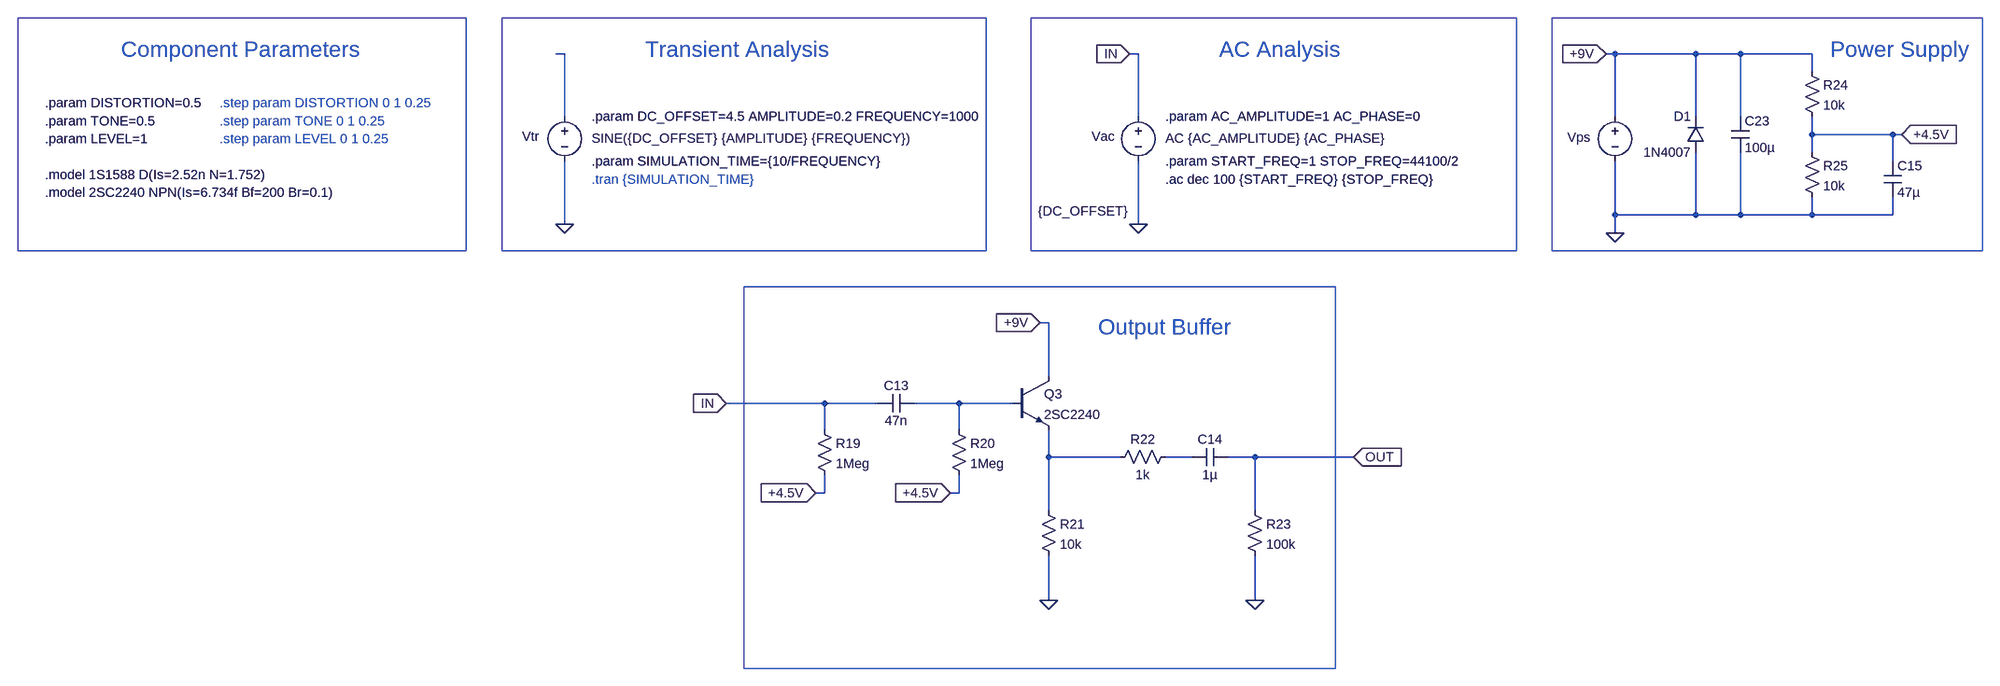
[diagram p0: schematic 6. Output Buffer.asc]
6. Output Buffer.asc, the LTspice schematic file:
Version 4
SHEET 1 6076 2100
WIRE 16 16 0 16
WIRE 1040 16 1024 16
WIRE 1904 16 1888 16
WIRE 2048 16 1904 16
WIRE 2128 16 2048 16
WIRE 2256 16 2128 16
WIRE 2256 48 2256 16
WIRE 16 128 16 16
WIRE 1040 128 1040 16
WIRE 1904 128 1904 16
WIRE 2048 128 2048 16
WIRE 2128 128 2128 16
WIRE 2256 160 2256 128
WIRE 2400 160 2256 160
WIRE 2416 160 2400 160
WIRE 2256 192 2256 160
WIRE 2400 208 2400 160
WIRE 1904 304 1904 208
WIRE 2048 304 2048 192
WIRE 2048 304 1904 304
WIRE 2128 304 2128 192
WIRE 2128 304 2048 304
WIRE 2256 304 2256 272
WIRE 2256 304 2128 304
WIRE 2400 304 2400 272
WIRE 2400 304 2256 304
WIRE 16 320 16 208
WIRE 1040 320 1040 208
WIRE 1904 336 1904 304
WIRE 880 496 864 496
WIRE 880 592 880 496
WIRE 480 640 304 640
WIRE 576 640 480 640
WIRE 720 640 640 640
WIRE 816 640 720 640
WIRE 480 688 480 640
WIRE 720 688 720 640
WIRE 880 736 880 688
WIRE 1008 736 880 736
WIRE 1136 736 1088 736
WIRE 1248 736 1200 736
WIRE 1424 736 1248 736
WIRE 480 800 480 768
WIRE 480 800 464 800
WIRE 720 800 720 768
WIRE 720 800 704 800
WIRE 880 832 880 736
WIRE 1248 832 1248 736
WIRE 880 992 880 912
WIRE 1248 992 1248 912
FLAG 1904 336 0
FLAG 1888 16 +9V
IOPIN 1888 16 In
FLAG 2416 160 +4.5V
IOPIN 2416 160 In
FLAG 1040 320 0
FLAG 16 320 0
FLAG 1424 736 OUT
IOPIN 1424 736 In
FLAG 1024 16 IN
IOPIN 1024 16 In
FLAG 880 992 0
FLAG 1248 992 0
FLAG 464 800 +4.5V
IOPIN 464 800 In
FLAG 704 800 +4.5V
IOPIN 704 800 In
FLAG 864 496 +9V
IOPIN 864 496 In
FLAG 304 640 IN
IOPIN 304 640 In
SYMBOL voltage 1904 112 R0
WINDOW 0 -85 53 Left 2
WINDOW 3 24 96 Invisible 2
WINDOW 123 0 0 Left 0
WINDOW 39 0 0 Left 0
SYMATTR InstName Vps
SYMATTR Value 9
SYMBOL cap 2112 128 R0
SYMATTR InstName C23
SYMATTR Value 100µ
SYMBOL cap 2384 208 R0
SYMATTR InstName C15
SYMATTR Value 47µ
SYMBOL res 2240 32 R0
SYMATTR InstName R24
SYMATTR Value 10k
SYMBOL res 2240 176 R0
SYMATTR InstName R25
SYMATTR Value 10k
SYMBOL diode 2064 192 R180
WINDOW 0 24 64 Left 2
WINDOW 3 24 0 Left 2
SYMATTR InstName D1
SYMATTR Value 1N4007
SYMBOL voltage 1040 112 R0
WINDOW 3 -179 185 Left 2
WINDOW 123 48 55 Left 2
WINDOW 39 0 0 Left 0
WINDOW 0 -83 52 Left 2
SYMATTR Value {DC_OFFSET}
SYMATTR Value2 AC {AC_AMPLITUDE} {AC_PHASE}
SYMATTR InstName Vac
SYMBOL voltage 16 112 R0
WINDOW 3 48 55 Left 2
WINDOW 123 29 129 Left 2
WINDOW 39 0 0 Left 0
WINDOW 0 -76 52 Left 2
SYMATTR Value SINE({DC_OFFSET} {AMPLITUDE} {FREQUENCY})
SYMATTR InstName Vtr
SYMBOL res 464 672 R0
SYMATTR InstName R19
SYMATTR Value 1Meg
SYMBOL res 704 672 R0
SYMATTR InstName R20
SYMATTR Value 1Meg
SYMBOL res 864 816 R0
SYMATTR InstName R21
SYMATTR Value 10k
SYMBOL res 1104 720 R90
WINDOW 0 0 56 VBottom 2
WINDOW 3 32 56 VTop 2
SYMATTR InstName R22
SYMATTR Value 1k
SYMBOL res 1232 816 R0
SYMATTR InstName R23
SYMATTR Value 100k
SYMBOL cap 640 624 R90
WINDOW 0 0 32 VBottom 2
WINDOW 3 32 32 VTop 2
SYMATTR InstName C13
SYMATTR Value 47n
SYMBOL cap 1200 720 R90
WINDOW 0 0 32 VBottom 2
WINDOW 3 32 32 VTop 2
SYMATTR InstName C14
SYMATTR Value 1µ
SYMBOL npn 816 592 R0
SYMATTR InstName Q3
SYMATTR Value 2SC2240
TEXT 2288 8 Left 4 ;Power Supply
TEXT -776 8 Left 4 ;Component Parameters
TEXT 1088 240 Left 2 !.ac dec 100 {START_FREQ} {STOP_FREQ}
TEXT 64 240 Left 2 ;.tran {SIMULATION_TIME}
TEXT -600 104 Left 2 ;.step param DISTORTION 0 1 0.25
TEXT -600 136 Left 2 ;.step param TONE 0 1 0.25
TEXT 968 504 Left 4 ;Output Buffer
TEXT 64 208 Left 2 !.param SIMULATION_TIME={10/FREQUENCY}
TEXT 160 8 Left 4 ;Transient Analysis
TEXT 64 128 Left 2 !.param DC_OFFSET=4.5 AMPLITUDE=0.2 FREQUENCY=1000
TEXT 1184 8 Left 4 ;AC Analysis
TEXT 1088 128 Left 2 !.param AC_AMPLITUDE=1 AC_PHASE=0
TEXT 1088 208 Left 2 !.param START_FREQ=1 STOP_FREQ=44100/2
TEXT -912 264 Left 2 !.model 2SC2240 NPN(Is=6.734f Bf=200 Br=0.1)
TEXT -912 232 Left 2 !.model 1S1588 D(Is=2.52n N=1.752)
TEXT -912 136 Left 2 !.param TONE=0.5
TEXT -912 168 Left 2 !.param LEVEL=1
TEXT -600 168 Left 2 ;.step param LEVEL 0 1 0.25
TEXT -912 104 Left 2 !.param DISTORTION=0.5
RECTANGLE Normal 1392 1120 336 432
RECTANGLE Normal 768 368 -96 -48
RECTANGLE Normal 1728 368 848 -48
RECTANGLE Normal 2560 368 1792 -48
RECTANGLE Normal -160 368 -960 -48

The netlist it stands for:
* 6. Output Buffer.asc
Vps +9V 0 9
C23 +9V 0 100µ
C15 +4.5V 0 47µ
R24 +9V +4.5V 10k
R25 +4.5V 0 10k
D1 0 +9V 1N4007
Vac IN 0 {DC_OFFSET} AC {AC_AMPLITUDE} {AC_PHASE}
Vtr N001 0 SINE({DC_OFFSET} {AMPLITUDE} {FREQUENCY})
R19 IN +4.5V 1Meg
R20 N002 +4.5V 1Meg
R21 N003 0 10k
R22 N004 N003 1k
R23 OUT 0 100k
C13 N002 IN 47n
C14 OUT N004 1µ
Q3 +9V N002 N003 0 2SC2240
.model D D
.lib standard.dio
.model NPN NPN
.model PNP PNP
.lib standard.bjt
* Power Supply
* Component Parameters
.ac dec 100 {START_FREQ} {STOP_FREQ}
* .tran {SIMULATION_TIME}
* .step param DISTORTION 0 1 0.25
* .step param TONE 0 1 0.25
* Output Buffer
.param SIMULATION_TIME={10/FREQUENCY}
* Transient Analysis
.param DC_OFFSET=4.5 AMPLITUDE=0.2 FREQUENCY=1000
* AC Analysis
.param AC_AMPLITUDE=1 AC_PHASE=0
.param START_FREQ=1 STOP_FREQ=44100/2
.model 2SC2240 NPN(Is=6.734f Bf=200 Br=0.1)
.model 1S1588 D(Is=2.52n N=1.752)
.param TONE=0.5
.param LEVEL=1
* .step param LEVEL 0 1 0.25
.param DISTORTION=0.5
.backanno
.end